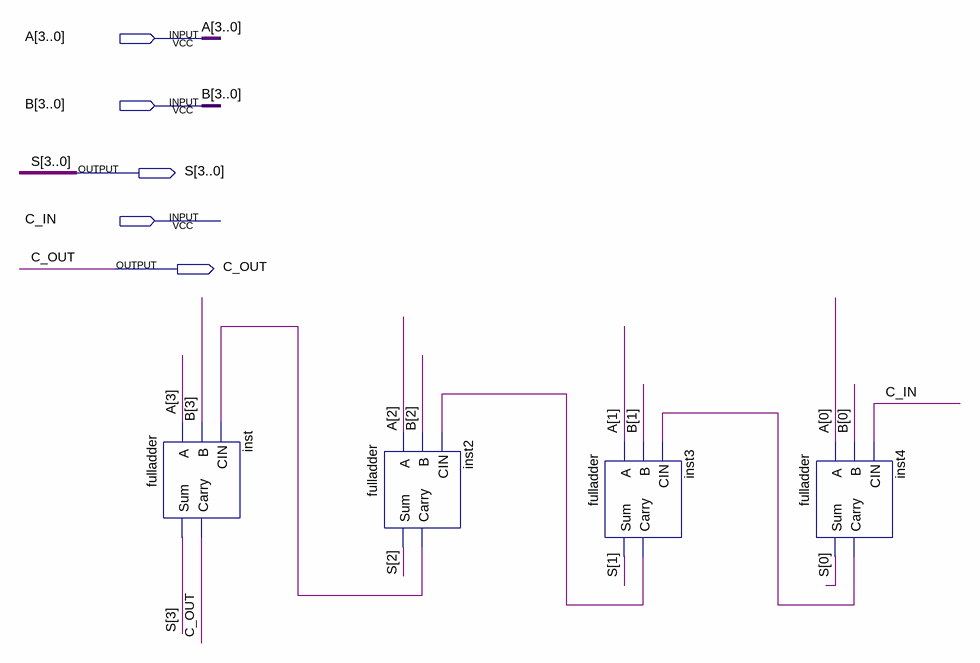
[diagram p0: schematic sheet]
// Quartus schematic fourbitadd.bdf as structural Verilog: 4 symbols, 5 pins
module fourbitadd (
  input  [3:0] A,
  input  [3:0] B,
  input  C_IN,
  output [3:0] S,
  output C_OUT
);

  wire inst2_carry, inst3_carry, inst4_carry;

  fulladder inst (.A(A[3]), .B(B[3]), .CIN(inst2_carry), .Sum(S[3]), .Carry(C_OUT));
  fulladder inst2 (.A(A[2]), .B(B[2]), .CIN(inst3_carry), .Sum(S[2]), .Carry(inst2_carry));
  fulladder inst3 (.A(A[1]), .B(B[1]), .CIN(inst4_carry), .Sum(S[1]), .Carry(inst3_carry));
  fulladder inst4 (.A(A[0]), .B(B[0]), .CIN(C_IN), .Sum(S[0]), .Carry(inst4_carry));
endmodule
